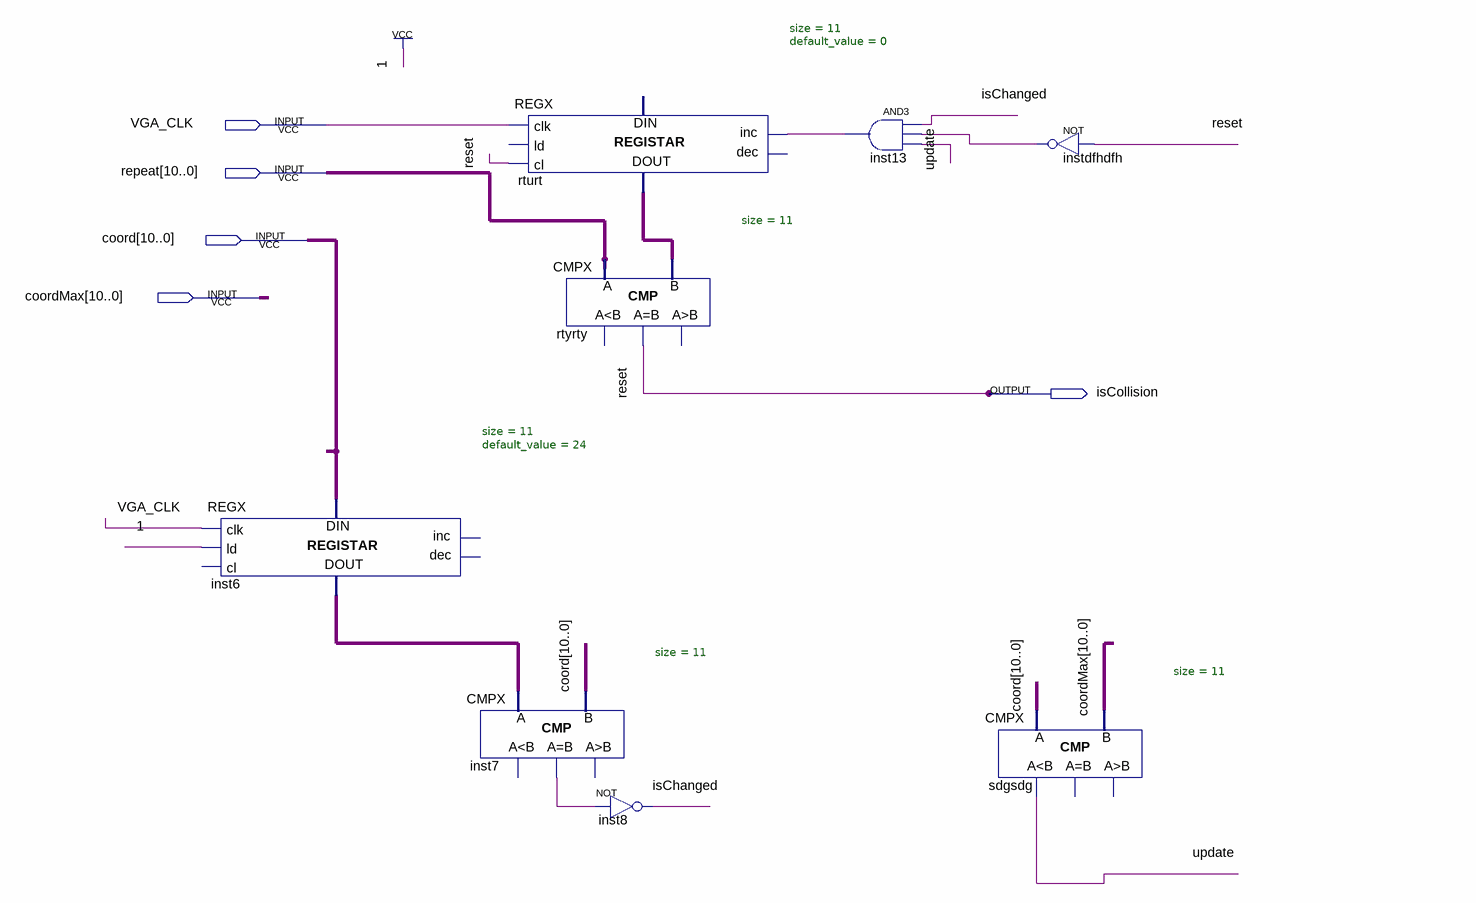
[diagram p0: schematic sheet]
// Quartus schematic line.bdf as structural Verilog: 8 symbols, 5 pins
module line (
  input  VGA_CLK,
  input  [10:0] \repeat ,
  input  [10:0] coord,
  input  [10:0] coordMax,
  output isCollision
);

  wire inst7_eq, inst13_out, instdfhdfh_out, isChanged, update;
  wire [10:0] inst6_data_out, rturt_data_out;

  REGX #(.size(11), .default_value(24)) inst6 (
    .clk(VGA_CLK), .ld(1'b1), .data_in(coord), .data_out(inst6_data_out));  // open: cl, inc, dec
  REGX #(.size(11), .default_value(0)) rturt (
    .clk(VGA_CLK), .cl(isCollision), .inc(inst13_out), .data_out(rturt_data_out));  // open: ld, dec, data_in
  CMPX #(.size(11)) inst7 (.A(inst6_data_out), .B(coord), .eq(inst7_eq));  // open: ls, gr
  CMPX #(.size(11)) rtyrty (.A(\repeat ), .B(rturt_data_out), .eq(isCollision));  // open: ls, gr
  not inst8 (isChanged, inst7_eq);
  and inst13 (inst13_out, isChanged, instdfhdfh_out, update);
  CMPX #(.size(11)) sdgsdg (.A(coord), .B(coordMax), .ls(update));  // open: eq, gr
  not instdfhdfh (instdfhdfh_out, isCollision);

  // Other names for the same wires on the sheet: reset = isCollision
endmodule
